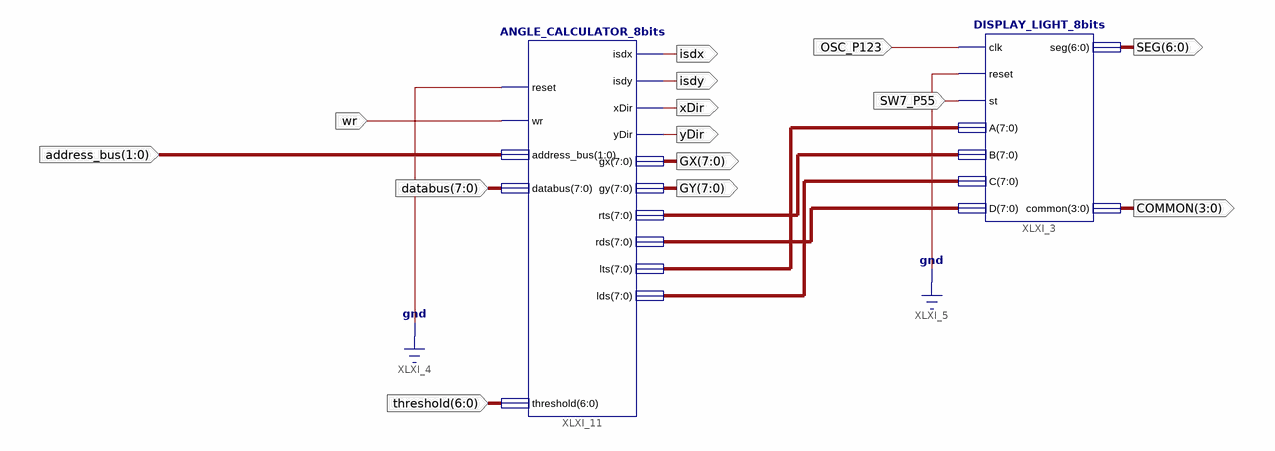
[diagram p0: schematic sheet 1]
// Xilinx ISE schematic main_input_processor_8bits.sch (spartan6) as structural Verilog: 2 symbols, 14 ports
module main_input_processor_8bits (
  input  OSC_P123,
  input  wr,
  input  [1:0] address_bus,
  input  [7:0] databus,
  input  SW7_P55,
  input  [6:0] threshold,
  output isdx,
  output isdy,
  output xDir,
  output yDir,
  output [7:0] GX,
  output [7:0] GY,
  output [6:0] SEG,
  output [3:0] COMMON
);

  wire [7:0] XLXN_1, XLXN_2, XLXN_3, XLXN_4;

  DISPLAY_LIGHT_8bits XLXI_3 (
    .clk(OSC_P123), .reset(1'b0), .st(SW7_P55), .A(XLXN_4), .B(XLXN_3), .C(XLXN_2), .D(XLXN_1), .seg(SEG),
    .common(COMMON));
  ANGLE_CALCULATOR_8bits XLXI_11 (
    .reset(1'b0), .wr(wr), .address_bus(address_bus), .databus(databus), .isdx(isdx), .isdy(isdy),
    .xDir(xDir), .yDir(yDir), .rts(XLXN_3), .rds(XLXN_1), .lts(XLXN_4), .lds(XLXN_2), .gx(GX), .gy(GY),
    .threshold(threshold));
endmodule
